# Altium schematic sheet power.SchDoc
size A
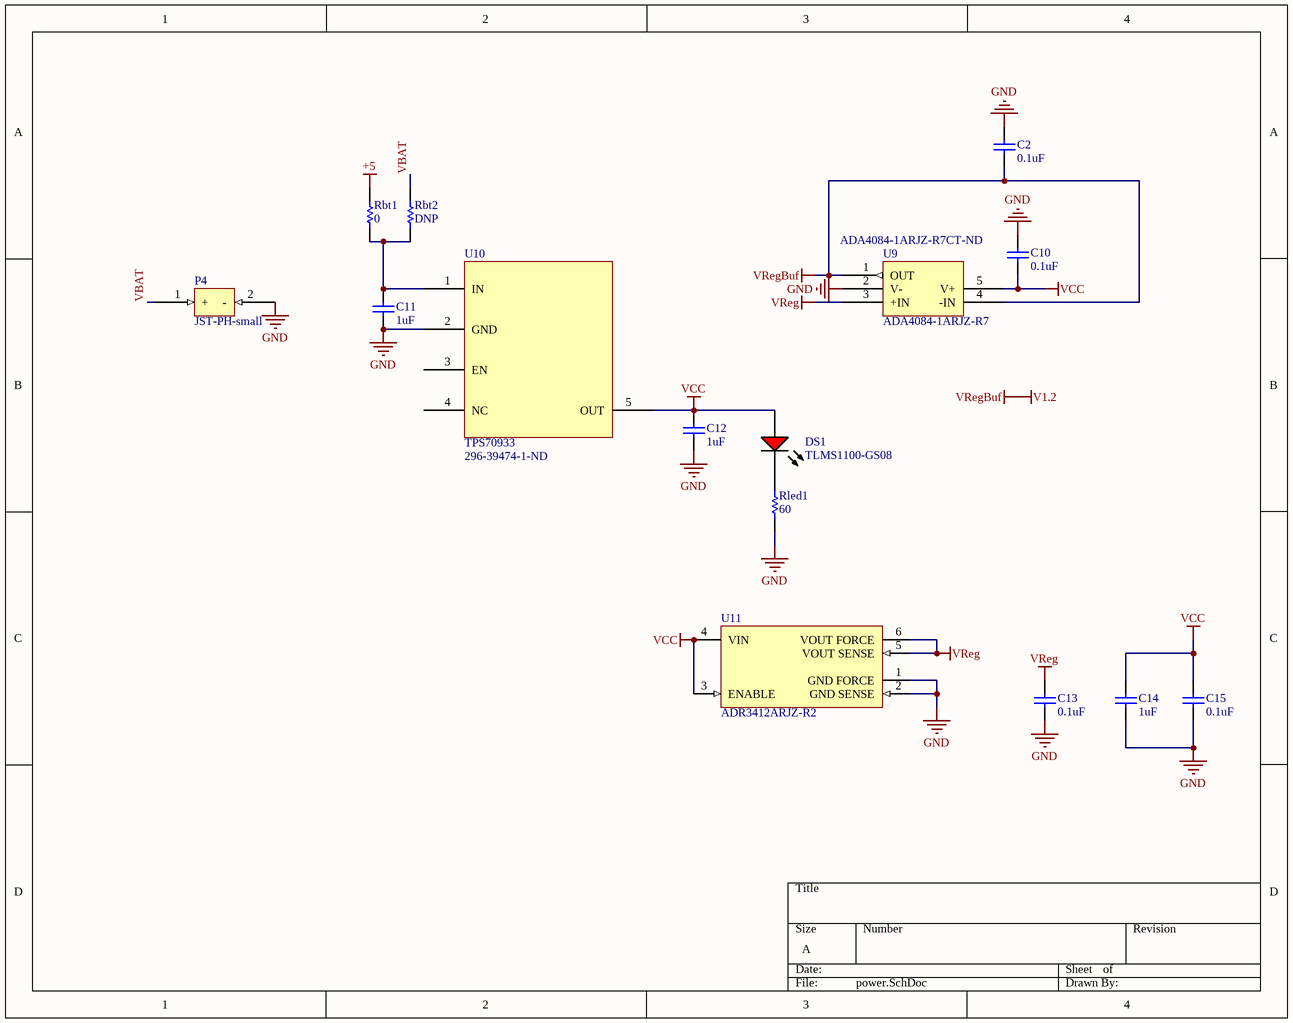
[diagram p0: power.SchDoc]

## Parts
C2  value 0.1uF  [0402]  (hidden comment: Cap)
C10  value 0.1uF  [0402]  (hidden comment: Cap)
C11  value 1uF  [0402]  (hidden comment: Cap)
C12  value 1uF  [0402]  (hidden comment: Cap)
C13  value 0.1uF  [0402]  (hidden comment: Cap)
C14  value 1uF  [0402]  (hidden comment: Cap)
C15  value 0.1uF  [0402]  (hidden comment: Cap)
DS1  TLMS1100-GS08  [VISH-TLMX1100_V]
P4  JST-PH-small  [JST-PH-small]
Rbt1  value 0  [0402]  (hidden comment: Res)
Rbt2  value DNP  [0402]  (hidden comment: Res)
Rled1  value 60  [0402]  (hidden comment: Res)
U9  ADA4084-1ARJZ-R7  Supplier Part Number 1: ADA4084-1ARJZ-R7CT-ND  [SOT95P280X145-5N]
U10  TPS70933  Supplier Part Number 1: 296-39474-1-ND  [SOT95P280X145-5N]
U11  ADR3412ARJZ-R2  [ADI-RJ-6_N]

## Nets
+5: Rbt1.2
GND: C2.2 C10.2 C11.2 C12.2 C13.1 C14.2 C15.1 P4.2(-) Rled1.1 U9.2(V-) U10.2(GND) U11.1(GND_FORCE) U11.2(GND_SENSE)
V1.2: C2.1 U9.1(OUT) U9.4(-IN)  [also labelled VRegBuf]
VCC: C10.1 C12.1 C14.1 C15.2 DS1.1(A) U9.5(V+) U10.5(OUT) U11.3(ENABLE) U11.4(VIN)
VReg: C13.2 U9.3(+IN) U11.5(VOUT_SENSE) U11.6(VOUT_FORCE)
VBAT: P4.1(+) Rbt2.2
NetC11_1: C11.1 Rbt1.1 Rbt2.1 U10.1(IN)
NetDS1_2: DS1.2(K) Rled1.2

Not connected (* = marked no-connect by the designer): U10 3(EN) 4(NC)

## Library data of the parts
C2 C10-C15 = Cap: Ceramic Capacitor (Surface Mount); Manufacturer: Generic Ceramic Chip Cap (TBD); Digi-Key Part Number: *; Manufacturer Part Number: *; Note: *; Rating: *
DS1 = CMP-1666-00027-1: LED, RED, 2.1 V, -40 to 100 degC, 2-Pin SMD (0603), RoHS, Tape and Reel; Type (Capacitors): C0G; Resistance: 100000000000 Ohm; Capacitance: 12 pF; Voltage Rating: 50 V; Tolerance: 5%; Min Operating Temperature: -55degC; REACH SVHC: No SVHC; ComponentLink2Description: Datasheet; ComponentLink1URL: http://www.vishay.com/; Width: 0.8 mm; Package Quantity: 4000; PackageReference: TLMX1100; ComponentLink2URL: http://www.vishay.com/docs/83173/tlmb1100.pdf; Case/Package: 0603; Case Code (Metric): 1608; Packaging: Tape and Reel; Pins: 2; ComponentLink1Description: Manufacturer URL; Max Operating Temperature: 125degC; Height: 0.8 mm; Length: 1.6 mm; Mount: Surface Mount; PackageDescription: 2-Pin Surface Mount Device, Body 1.6 x 0.8 mm; DatasheetVersion: Rev. 2.7, 03/2016; Case Code (Imperial): 0603; Voltage Rating (DC): 50 V; RoHSCompliant: True; Radiation Hardening: No
Rbt1 Rbt2 Rled1 = Res: Chip Resistor (Surface Mount); Manufacturer: Generic Chip Res (TBD); Manufacturer Part Number: *; Digi-Key Part Number: *; Rating: *
U9 = ADA4622-1ARJZ: 30 V, 8 MHz, Low Bias Current, / Single-Supply, RRO, Precision Op Amps; ComponentLink1Description: Datasheet; ComponentLink1URL: http://www.analog.com/media/en/technical-documentation/data-sheets/ada4622-1-4622-2-4622-4.pdf; Supplier 1: Digi-Key
U10 = TPS70933: 3.3V Ultra low power Voltage Regulator; Supplier 1: Digi-Key
U11 = CMP-0784-00363-1: Micropower, High Accuracy Voltage Reference, 1.2 V Output, 2.3 to 5.5 V Supply, Industrial, 6-pin SOT23 (RJ-6), Reel; Manufacturer: Analog Devices; Vout: 1.2V; Max V Supply (V): 5.5; Min V Supply (V): 2.3; Ref Out TC (ppm/C): 8; Mounting Technology: Surface Mount; DatasheetVersion: Rev. B; Code_JEDEC: MO-178-AB; ComponentLink3URL: http://www.analog.com/static/imported-files/packages/PKG_PDF/SOT-23(RJ)/RJ_6.pdf; ComponentLink2Description: Datasheet; ComponentLink1URL: http://www.analog.com/en/index.html; ComponentLink2URL: http://www.analog.com/static/imported-files/data_sheets/ADR3412_ADR3420_ADR3425_ADR3430_ADR3433_ADR3440_ADR3450.pdf; Packing: Reel; ComponentLink4Description: URL Link1; Operating Temp Range: -40 to 125 degC; ComponentLink4URL: Product URL:http://www.analog.com/en/special-linear-functions/voltage-references/adr3412/products/product.html; ComponentLink3Description: Package Specification; PartNumber: ADR3412ARJZ-R2; PackageReference: RJ-6; PackageVersion: 121608-A, 12/2008; ComponentLink1Description: Manufacturer URL; PackageDescription: 6-Pin Small Outline Transistor Package, Body 2.9 x 1.6 mm, Pitch 0.95 mm